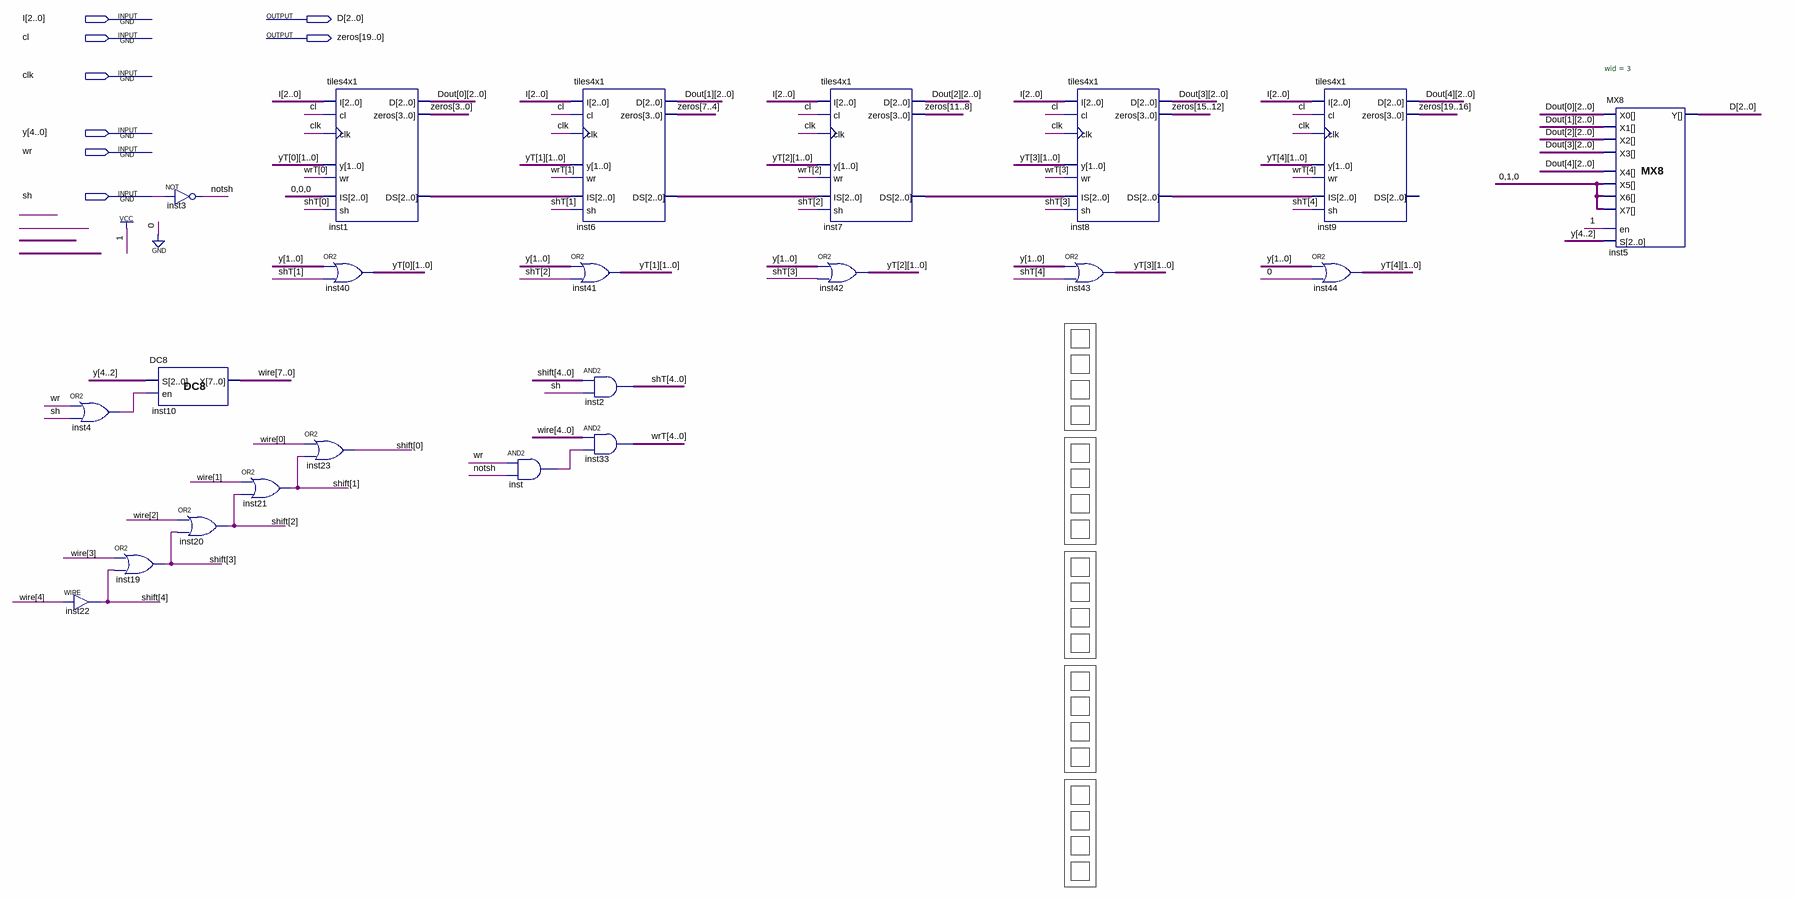
[diagram p0: schematic sheet]
// Quartus schematic tiles20x1.bdf as structural Verilog: 22 symbols, 8 pins
module tiles20x1 (
  input  [2:0] I,
  input  cl,
  input  clk,
  input  [4:0] y,
  input  wr,
  input  sh,
  output [2:0] D,
  output [19:0] zeros
);

  wire inst4_out, inst_out, notsh;
  wire [1:0] yT_0, yT_1, yT_2, yT_3, yT_4;
  wire [2:0] Dout_0, Dout_1, Dout_2, Dout_3, Dout_4, inst1_ds, inst6_ds, inst7_ds, inst8_ds;
  wire [4:0] shift, shT, wrT;
  wire [7:0] \wire ;

  or inst4 (inst4_out, wr, sh);
  assign shift[4] = \wire [4];  // WIRE inst22
  or inst19 (shift[3], \wire [3], shift[4]);
  not inst3 (notsh, sh);
  DC8 inst10 (.S(y[4:2]), .en(inst4_out), .X(\wire ));
  or inst20 (shift[2], \wire [2], shift[3]);
  or inst21 (shift[1], \wire [1], shift[2]);
  tiles4x1 inst1 (
    .I(I), .cl(cl), .clk(clk), .y(yT_0), .wr(wrT[0]), .IS(3'b000), .sh(shT[0]), .D(Dout_0),
    .zeros(zeros[3:0]), .DS(inst1_ds));
  assign yT_0 = y[1:0] | {2{shT[1]}};  // OR2 inst40, 2 bits wide
  or inst23 (shift[0], \wire [0], shift[1]);
  and inst (inst_out, wr, notsh);
  tiles4x1 inst6 (
    .I(I), .cl(cl), .clk(clk), .y(yT_1), .wr(wrT[1]), .IS(inst1_ds), .sh(shT[1]), .D(Dout_1),
    .zeros(zeros[7:4]), .DS(inst6_ds));
  assign yT_1 = y[1:0] | {2{shT[2]}};  // OR2 inst41, 2 bits wide
  assign shT = shift & {5{sh}};  // AND2 inst2, 5 bits wide
  assign wrT = \wire [4:0] & {5{inst_out}};  // AND2 inst33, 5 bits wide
  tiles4x1 inst7 (
    .I(I), .cl(cl), .clk(clk), .y(yT_2), .wr(wrT[2]), .IS(inst6_ds), .sh(shT[2]), .D(Dout_2),
    .zeros(zeros[11:8]), .DS(inst7_ds));
  assign yT_2 = y[1:0] | {2{shT[3]}};  // OR2 inst42, 2 bits wide
  tiles4x1 inst8 (
    .I(I), .cl(cl), .clk(clk), .y(yT_3), .wr(wrT[3]), .IS(inst7_ds), .sh(shT[3]), .D(Dout_3),
    .zeros(zeros[15:12]), .DS(inst8_ds));
  assign yT_3 = y[1:0] | {2{shT[4]}};  // OR2 inst43, 2 bits wide
  tiles4x1 inst9 (
    .I(I), .cl(cl), .clk(clk), .y(yT_4), .wr(wrT[4]), .IS(inst8_ds), .sh(shT[4]), .D(Dout_4),
    .zeros(zeros[19:16]));  // open: DS
  assign yT_4 = y[1:0] | 2'b00;  // OR2 inst44, 2 bits wide
  MX8 #(.wid(3)) inst5 (
    .X0(Dout_0), .X1(Dout_1), .X2(Dout_2), .X3(Dout_3), .X4(Dout_4), .X5(3'b010), .X6(3'b010), .X7(3'b010),
    .en(1'b1), .S(y[4:2]), .Y(D));
endmodule
